# EAGLE design rodentdbs (EAGLE 9.6.2)

## Sheet 1 of 2
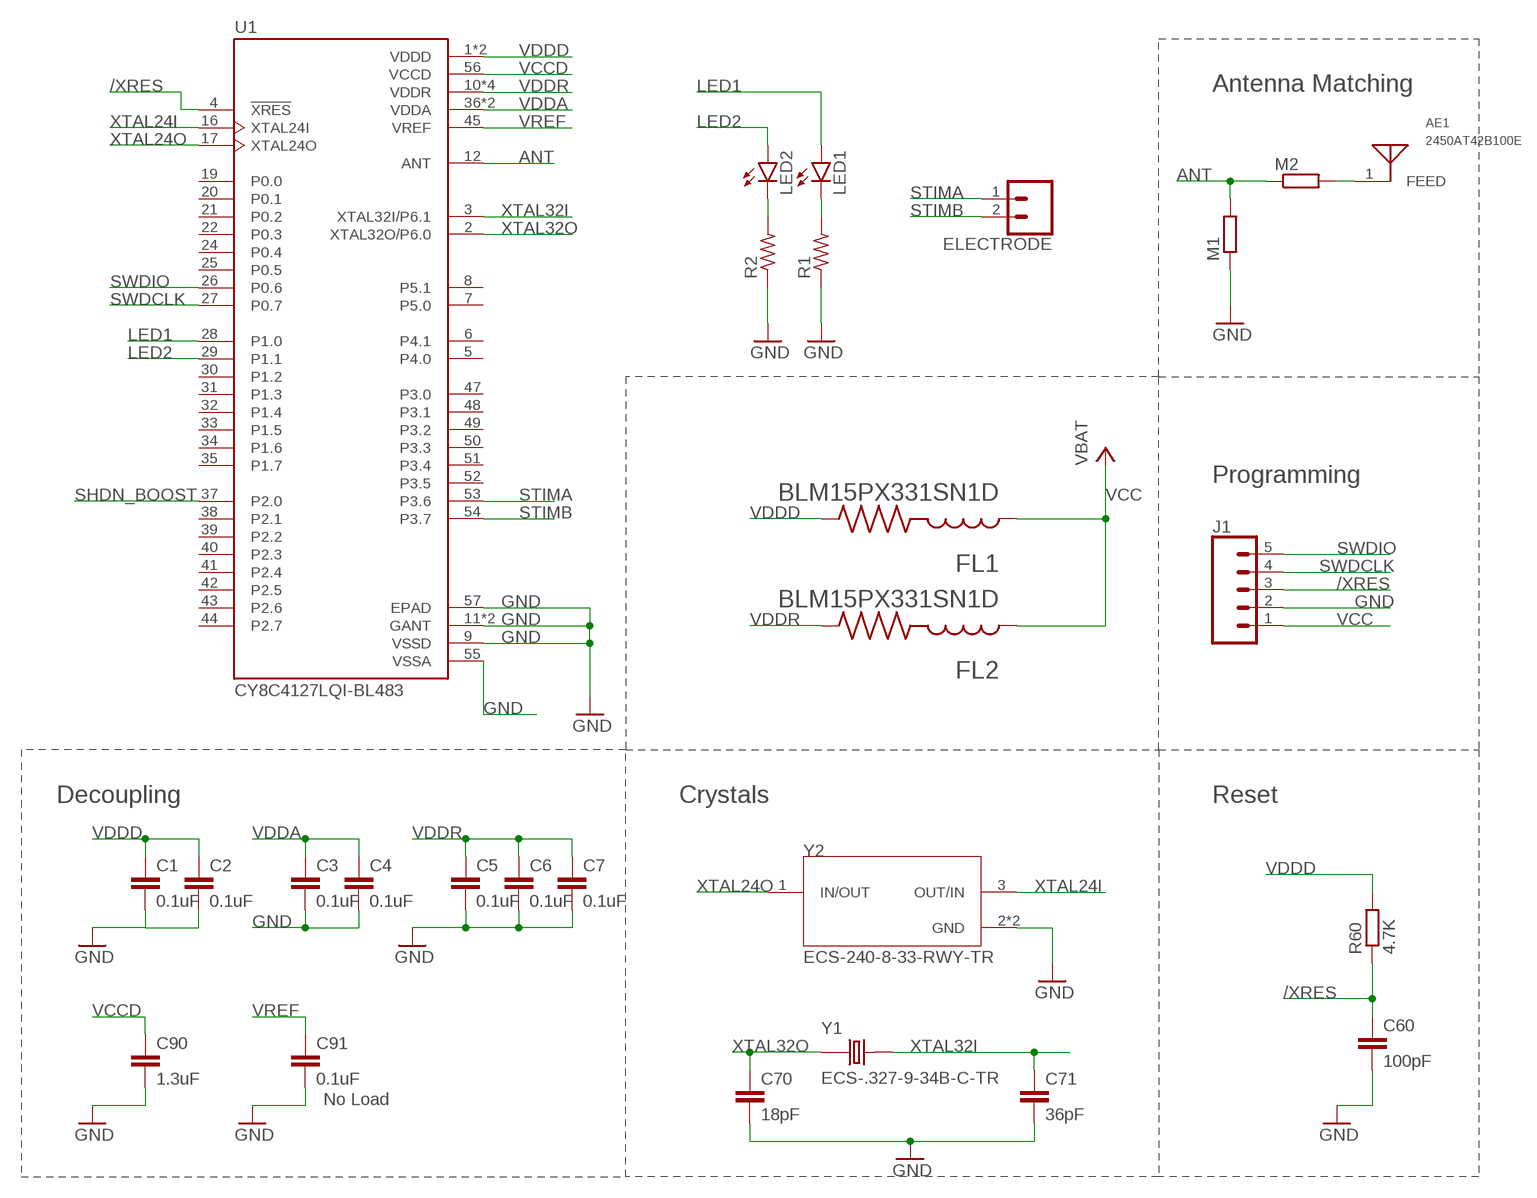
[diagram p0: schematic, sheet 1]

### Parts
AE1  2450AT42B100E  [XCVR_2450AT42B100E]
C1  0.1uF  C-EUC0402  [C0402]
C2  0.1uF  C-EUC0402  [C0402]
C3  0.1uF  C-EUC0402  [C0402]
C4  0.1uF  C-EUC0402  [C0402]
C5  0.1uF  C-EUC0402  [C0402]
C6  0.1uF  C-EUC0402  [C0402]
C7  0.1uF  C-EUC0402  [C0402]
C60  100pF  C-EUC0402  [C0402]
C70  18pF  C-EUC0402  [C0402]
C71  36pF  C-EUC0402  [C0402]
C90  1.3uF  C-EUC0402  [C0402]
C91  0.1uF  C-EUC0402  [C0402]
ELECTRODE  CONN_02  [1X02]
FL1  BLM15PX331SN1D  [BEADC1005X55N]
FL2  BLM15PX331SN1D  [BEADC1005X55N]
J1  CONN_05LOCK  [1X05_LOCK]
LED1  LEDSML0603  [SML0603]
LED2  LEDSML0603  [SML0603]
M1  R-EU_R0402  [R0402]
M2  R-EU_R0402  [R0402]
R1  R-US_R0402  [R0402]
R2  R-US_R0402  [R0402]
R60  4.7K  R-EU_R0402  [R0402]
U1  CY8C4127LQI-BL483  [QFN40P700X700X60-57N]
Y1  ECS-.327-9-34B-C-TR  [XTAL_ECS-.327-9-34B-C-TR]
Y2  ECS-240-8-33-RWY-TR  [XTAL_ECS-240-8-33-RWY-TR]

### Nets
/XRES: C60.1 J1.3 R60.1 U1.4(!XRES)
ANT: M1.2 M2.1 U1.12(ANT)
GND: C1.2 C2.2 C3.2 C4.2 C5.2 C6.2 C7.2 C60.2 C70.2 C71.2 C90.2 C91.2 J1.2 M1.1 R1.1 R2.1 U1.9(VSSD) U1.11(GANT) U1.13(GANT) U1.55(VSSA) U1.57(EPAD) Y2.2(GND) Y2.4(GND) ; also sheet 2
LED1: LED1.A U1.28(P1.0)
LED2: LED2.A U1.29(P1.1)
N$1: LED1.C R1.2
N$2: AE1.1(FEED) M2.2
N$3: LED2.C R2.2
SHDN_BOOST: U1.37(P2.0)
STIMA: ELECTRODE.1 U1.53(P3.6)
STIMB: ELECTRODE.2 U1.54(P3.7)
SWDCLK: J1.4 U1.27(P0.7)
SWDIO: J1.5 U1.26(P0.6)
VCC: FL1.1 FL2.1 J1.1 ; supply symbol labelled VBAT ; also sheet 2
VCCD: C90.1 U1.56(VCCD)
VDDA: C3.1 C4.1 U1.36(VDDA) U1.46(VDDA) ; also sheet 2
VDDD: C1.1 C2.1 FL1.2 R60.2 U1.1(VDDD) U1.23(VDDD)
VDDR: C5.1 C6.1 C7.1 FL2.2 U1.10(VDDR) U1.14(VDDR) U1.15(VDDR) U1.18(VDDR)
VREF: C91.1 U1.45(VREF)
XTAL24I: U1.16(XTAL24I) Y2.3(OUT/IN)
XTAL24O: U1.17(XTAL24O) Y2.1(IN/OUT)
XTAL32I: C71.1 U1.3(XTAL32I/P6.1) Y1.2
XTAL32O: C70.1 U1.2(XTAL32O/P6.0) Y1.1
Unconnected: U1.5(P4.0) U1.6(P4.1) U1.7(P5.0) U1.8(P5.1) U1.19(P0.0) U1.20(P0.1) U1.21(P0.2) U1.22(P0.3) U1.24(P0.4) U1.25(P0.5) U1.30(P1.2) U1.31(P1.3) U1.32(P1.4) U1.33(P1.5) U1.34(P1.6) U1.35(P1.7) U1.38(P2.1) U1.39(P2.2) U1.40(P2.3) U1.41(P2.4) U1.42(P2.5) U1.43(P2.6) U1.44(P2.7) U1.47(P3.0) U1.48(P3.1) U1.49(P3.2) U1.50(P3.3) U1.51(P3.4) U1.52(P3.5)

### Notes on the sheet
- Antenna Matching
- Programming
- Decoupling | Crystals | Reset
- No Load

## Sheet 2 of 2: Battery Boost
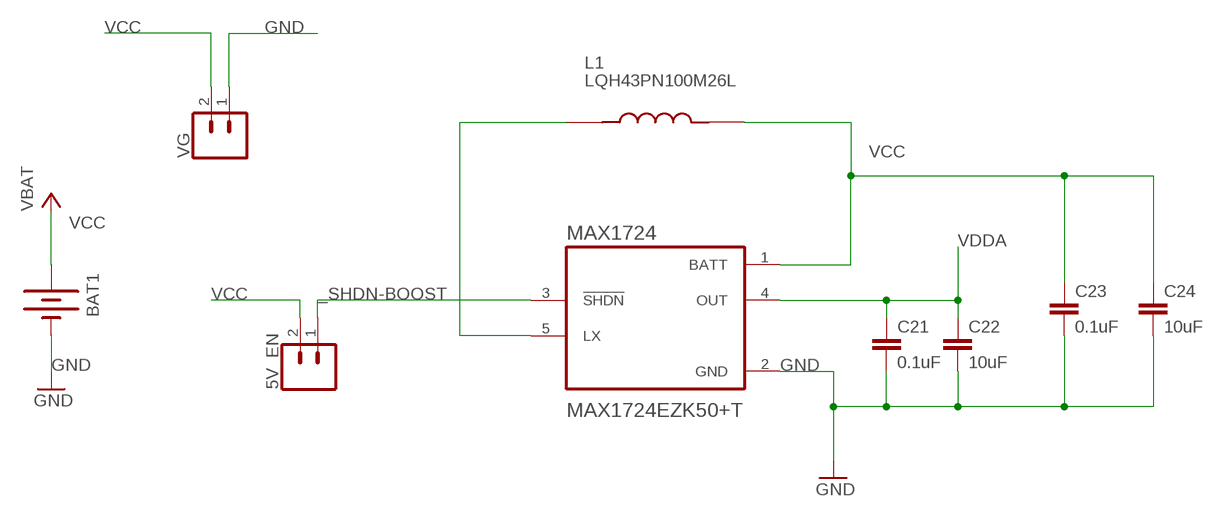
[diagram p1: schematic, sheet 2]

### Parts
5V_EN  CONN_02  [1X02]
BAT1  BATTERYBU2032SM  [BU2032SM]
C21  0.1uF  C-EUC0402  [C0402]
C22  10uF  C-EUC0603  [C0603]
C23  0.1uF  C-EUC0402  [C0402]
C24  10uF  C-EUC0603  [C0603]
L1  LQH43PN100M26L  [IND_LQH43PN100M26L]
MAX1724  MAX1724EZK50+T  [SOT95P275X110-5N]
VG  CONN_02  [1X02]

### Nets
_SHDN-BOOST: 5V_EN.1 MAX1724.3(!SHDN)
GND: BAT1.P$2(-) C21.2 C22.2 C23.2 C24.2 MAX1724.2(GND) VG.1 ; also sheet 1
N$8: L1.1 MAX1724.5(LX)
VCC: 5V_EN.2 BAT1.P$1(+) C23.1 C24.1 L1.2 MAX1724.1(BATT) VG.2 ; supply symbol labelled VBAT ; also sheet 1
VDDA: C21.1 C22.1 MAX1724.4(OUT) ; also sheet 1

## Library data of the parts
5V_EN ELECTRODE VG = SparkFun-Connectors:CONN_02: Multi connection point. Often used as Generic Header-pin footprint for 0.1 inch spaced/style header connections On any of the 0.1 inch spaced packages, you can populate with these: Break Away Headers - Straight <https://www.sparkfun.com/products/116> (PRT-00116) Break Away Male Headers - Right Angle <https://www.sparkfun.com/products/553> (PRT-00553) Female Headers <https://www.sparkfun.com/products/115> (PRT-00115) Break Away Headers - Machine Pin <https://www.sparkfun.com/products/117> (PRT-00117) Break Away Female Headers - Swiss Machine Pin <https://www.sparkfun.com/products/743> (PRT-00743) For SCREWTERMINALS and SPRING TERMINALS visit here: Screw Terimnals on SparkFun.com <https://www.sparkfun.com/search/results?term=Screw+Terminals> (5mm/3.5mm/2.54mm spacing) This device is also useful as a general connection point to wire up your design to another part of your project. Our various solder wires solder well into these plated through hole pads. Hook-Up Wire - Assortment (Stranded, 22 AWG) <https://www.sparkfun.com/products/11375> (PRT-11375) Hook-Up Wire - Assortment (Solid Core, 22 AWG) <https://www.sparkfun.com/products/11367> (PRT-11367) View the entire wire category on our website here <https://www.sparkfun.com/categories/141> Special notes: Molex polarized connector foot print use with: PRT-08233 with associated crimp pins and housings. 2.54_SCREWTERM for use with PRT-10571. 3.5mm Screw Terminal footprints for PRT-08084 5mm Screw Terminal footprints for use with PRT-08432
AE1 = 2450AT42B100E:2450AT42B100E: Antenna Chip 2.4ghz; DESCRIPTION: 2.4GHz - Chip RF Antenna 2.4GHz ~ 2.5GHz 0dBi Solder Surface Mount; DIGI-KEY_PART_NUMBER: 712-1008-2-ND; MF: Johanson Technology; MP: 2450AT42B100E; PACKAGE: None; PURCHASE-URL: https://pricing.snapeda.com/search/part/2450AT42B100E/?ref=eda
BAT1 = ELEC327:BATTERY: Battery Holders Various common sizes : AA, AAA, 20mm coin cell and 12mm coin cell. 20MM_4LEGS, BATT-10373
C1-C7 C21-C24 C60 C70 C71 C90 C91 = rcl:C-EU: CAPACITOR, European symbol; SPICEPREFIX: C
FL1 FL2 = BLM15PX331SN1D:BLM15PX331SN1D: BLM Series 0402 330 Ohm 1200 mA 0.15 Ohm DCR Surface Mount Ferrite Bead; DESCRIPTION: 330 Ohms @ 100 MHz 1 Power Line Ferrite Bead 0402 (1005 Metric) 1.2A 150mOhm; DIGI-KEY_PART_NUMBER: 490-11022-2-ND; MF: Murata Electronics; MP: BLM15PX331SN1D; PACKAGE: 1005 Taiyo Yuden; PURCHASE-URL: https://pricing.snapeda.com/search/part/BLM15PX331SN1D/?ref=eda
J1 = SparkFun-Connectors:CONN_05: Multi connection point. Often used as Generic Header-pin footprint for 0.1 inch spaced/style header connections On any of the 0.1 inch spaced packages, you can populate with these: Break Away Headers - Straight <https://www.sparkfun.com/products/116> (PRT-00116) Break Away Male Headers - Right Angle <https://www.sparkfun.com/products/553> (PRT-00553) Female Headers <https://www.sparkfun.com/products/115> (PRT-00115) Break Away Headers - Machine Pin <https://www.sparkfun.com/products/117> (PRT-00117) Break Away Female Headers - Swiss Machine Pin <https://www.sparkfun.com/products/743> (PRT-00743) For SCREWTERMINALS and SPRING TERMINALS visit here: Screw Terimnals on SparkFun.com <https://www.sparkfun.com/search/results?term=Screw+Terminals> (5mm/3.5mm/2.54mm spacing) This device is also useful as a general connection point to wire up your design to another part of your project. Our various solder wires solder well into these plated through hole pads. Hook-Up Wire - Assortment (Stranded, 22 AWG) <https://www.sparkfun.com/products/11375> (PRT-11375) Hook-Up Wire - Assortment (Solid Core, 22 AWG) <https://www.sparkfun.com/products/11367> (PRT-11367) View the entire wire category on our website here <https://www.sparkfun.com/categories/141> Special notes: Molex polarized connector foot print use with SKU : PRT-08231 with associated crimp pins and housings. 1MM SMD Version SKU: PRT-10208
L1 = LQH43PN100M26L:LQH43PN100M26L: Inductor Power Chip Unshielded Wirewound 10uH 10% 1MHz Ferrite 650mA 240mOhm DCR 1812 T/R; DESCRIPTION: Inductor with Inductance: 10uH Tol. +/-20%, Package: 1812 (4532); DIGI-KEY_PART_NUMBER: 490-12780-1-ND; MF: Murata; MP: LQH43PN100M26L; PACKAGE: NONSTANDARD; PURCHASE-URL: https://pricing.snapeda.com/search/part/LQH43PN100M26L/?ref=eda
LED1 LED2 = led:LED: LED OSRAM: - CHIPLED LG R971, LG N971, LY N971, LG Q971, LY Q971, LO R971, LY R971 LH N974, LH R974 LS Q976, LO Q976, LY Q976 LO Q996 - Hyper CHIPLED LW Q18S LB Q993, LB Q99A, LB R99A - SideLED LS A670, LO A670, LY A670, LG A670, LP A670 LB A673, LV A673, LT A673, LW A673 LH A674 LY A675 LS A676, LA A676, LO A676, LY A676, LW A676 LS A679, LY A679, LG A679 - Hyper Micro SIDELED® LS Y876, LA Y876, LO Y876, LY Y876 LT Y87S - SmartLED LW L88C, LW L88S LB L89C, LB L89S, LG L890 LS L89K, LO L89K, LY L89K LS L896, LA L896, LO L896, LY L896 - TOPLED LS T670, LO T670, LY T670, LG T670, LP T670 LSG T670, LSP T670, LSY T670, LOP T670, LYG T670 LG T671, LOG T671, LSG T671 LB T673, LV T673, LT T673, LW T673 LH T674 LS T676, LA T676, LO T676, LY T676, LB T676, LH T676, LSB T676, LW T676 LB T67C, LV T67C, LT T67C, LS T67K, LO T67K, LY T67K, LW E67C LS E67B, LA E67B, LO E67B, LY E67B, LB E67C, LV E67C, LT E67C LW T67C LS T679, LY T679, LG T679 LS T770, LO T770, LY T770, LG T770, LP T770 LB T773, LV T773, LT T773, LW T773 LH T774 LS E675, LA E675, LY E675, LS T675 LS T776, LA T776, LO T776, LY T776, LB T776 LHGB T686 LT T68C, LB T68C - Hyper Mini TOPLED® LB M676 - Mini TOPLED Santana® LG M470 LS M47K, LO M47K, LY M47K Source: http://www.osram.convergy.de LUXEON: - LUMILED® LXK2-PW12-R00, LXK2-PW12-S00, LXK2-PW14-U00, LXK2-PW14-V00 LXK2-PM12-R00, LXK2-PM12-S00, LXK2-PM14-U00 LXK2-PE12-Q00, LXK2-PE12-R00, LXK2-PE12-S00, LXK2-PE14-T00, LXK2-PE14-U00 LXK2-PB12-K00, LXK2-PB12-L00, LXK2-PB12-M00, LXK2-PB14-N00, LXK2-PB14-P00, LXK2-PB14-Q00 LXK2-PR12-L00, LXK2-PR12-M00, LXK2-PR14-Q00, LXK2-PR14-R00 LXK2-PD12-Q00, LXK2-PD12-R00, LXK2-PD12-S00 LXK2-PH12-R00, LXK2-PH12-S00 LXK2-PL12-P00, LXK2-PL12-Q00, LXK2-PL12-R00 Source: www.luxeon.com KINGBRIGHT: KA-3528ASYC Source: www.kingbright.com
M1 M2 R60 = rcl:R-EU_: RESISTOR, European symbol; SPICEPREFIX: R
MAX1724 = MAX1724EZK50_T:MAX1724EZK50+T; DESCRIPTION: Boost Switching Regulator IC Positive Fixed 5V 1 Output 400mA (Switch) SOT-23-5 Thin, TSOT-23-5; DIGI-KEY_PART_NUMBER: MAX1724EZK50+TCT-ND; MF: Maxim Integrated; MP: MAX1724EZK50+T; PACKAGE: SOT-23-5 Maxim; PURCHASE-URL: https://pricing.snapeda.com/search/part/MAX1724EZK50+T/?ref=eda
R1 R2 = rcl:R-US_: RESISTOR, American symbol; SPICEPREFIX: R
U1 = CY8C4127FNI-BL483T:CY8C4127LQI-BL483
Y1 = ECS-.327-9-34B-C-TR:ECS-.327-9-34B-C-TR: Crystal 2-SMD, No Lead; DESCRIPTION: 32.768 kHz ±10ppm Crystal 9pF 70 kOhms 2-SMD, No Lead; DIGI-KEY_PART_NUMBER: XC1949TR-ND; MF: ECS Inc.; MP: ECS-.327-9-34B-C-TR; PACKAGE: None; PURCHASE-URL: https://pricing.snapeda.com/search/part/ECS-.327-9-34B-C-TR/?ref=eda
Y2 = ECS-240-8-33-RWY-TR:ECS-240-8-33-RWY-TR; DESCRIPTION: Crystal 24MHz ±15ppm (Tol) ±15ppm (Stability) 8pF FUND 40Ohm 4-Pin Mini-CSMD T/R; DIGI-KEY_PART_NUMBER: XC2946TR-ND; MF: ECS Inc.; MP: ECS-240-8-33-RWY-TR; PACKAGE: SMD-4 ECS International; PURCHASE-URL: https://pricing.snapeda.com/search/part/ECS-240-8-33-RWY-TR/?ref=eda

## Board
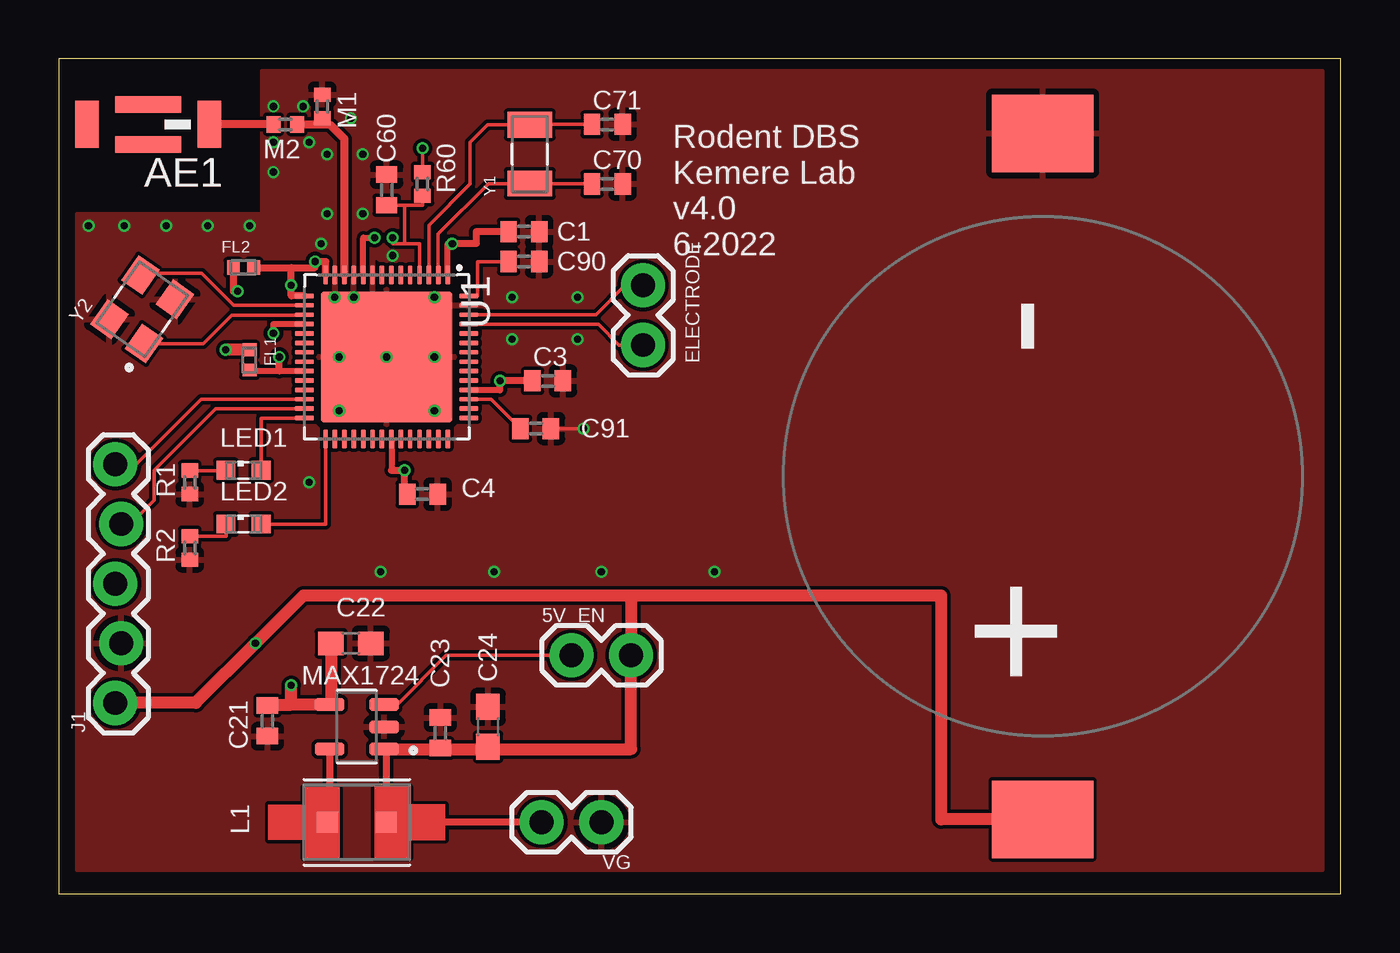
[diagram p2: board, top side]
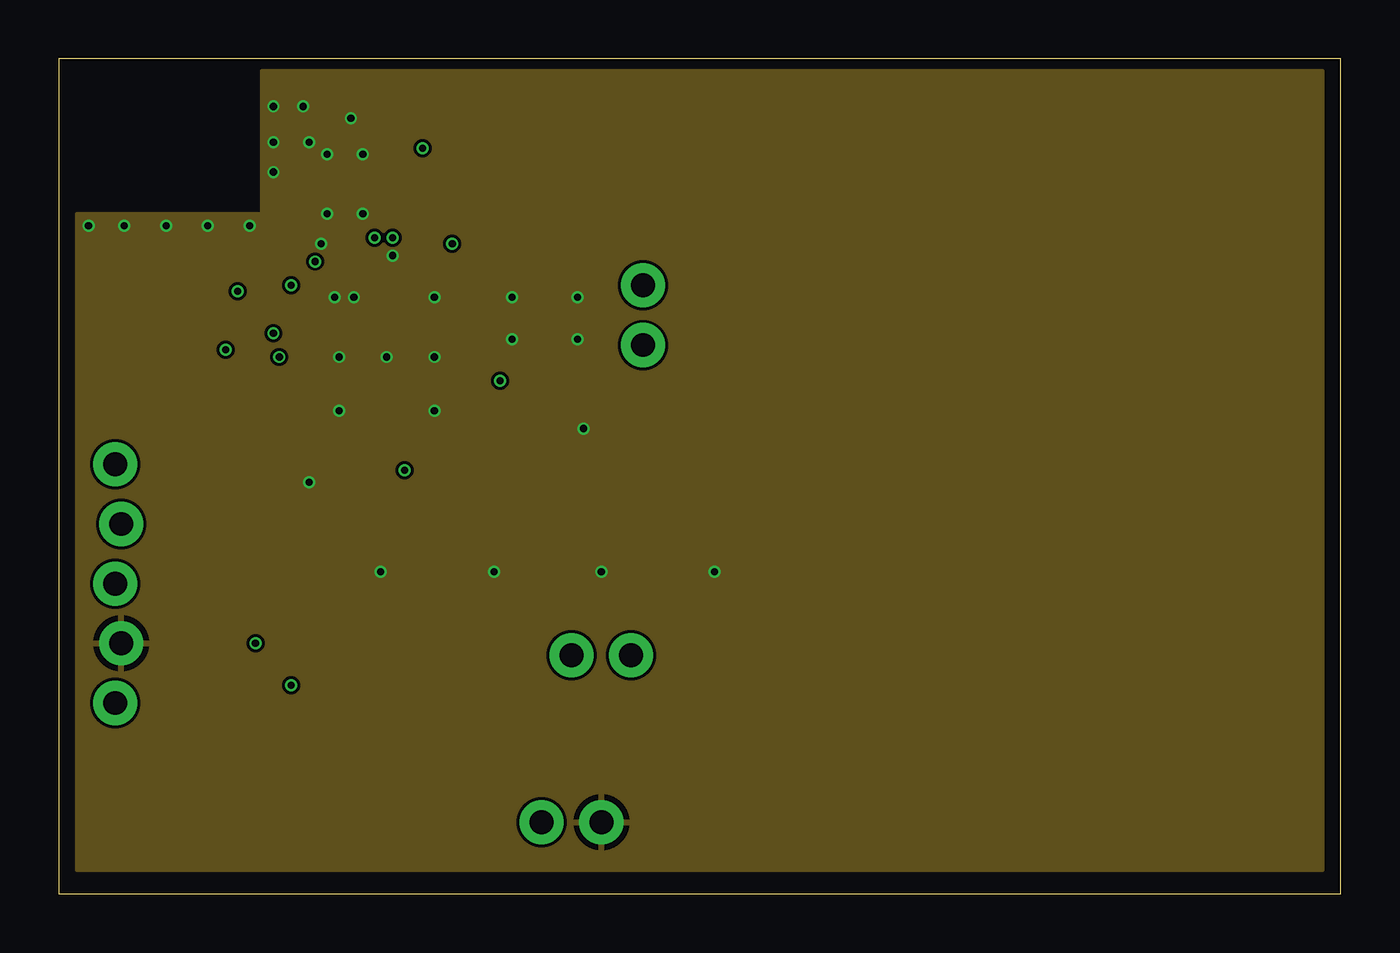
[diagram p3: board, inner layer Route2]
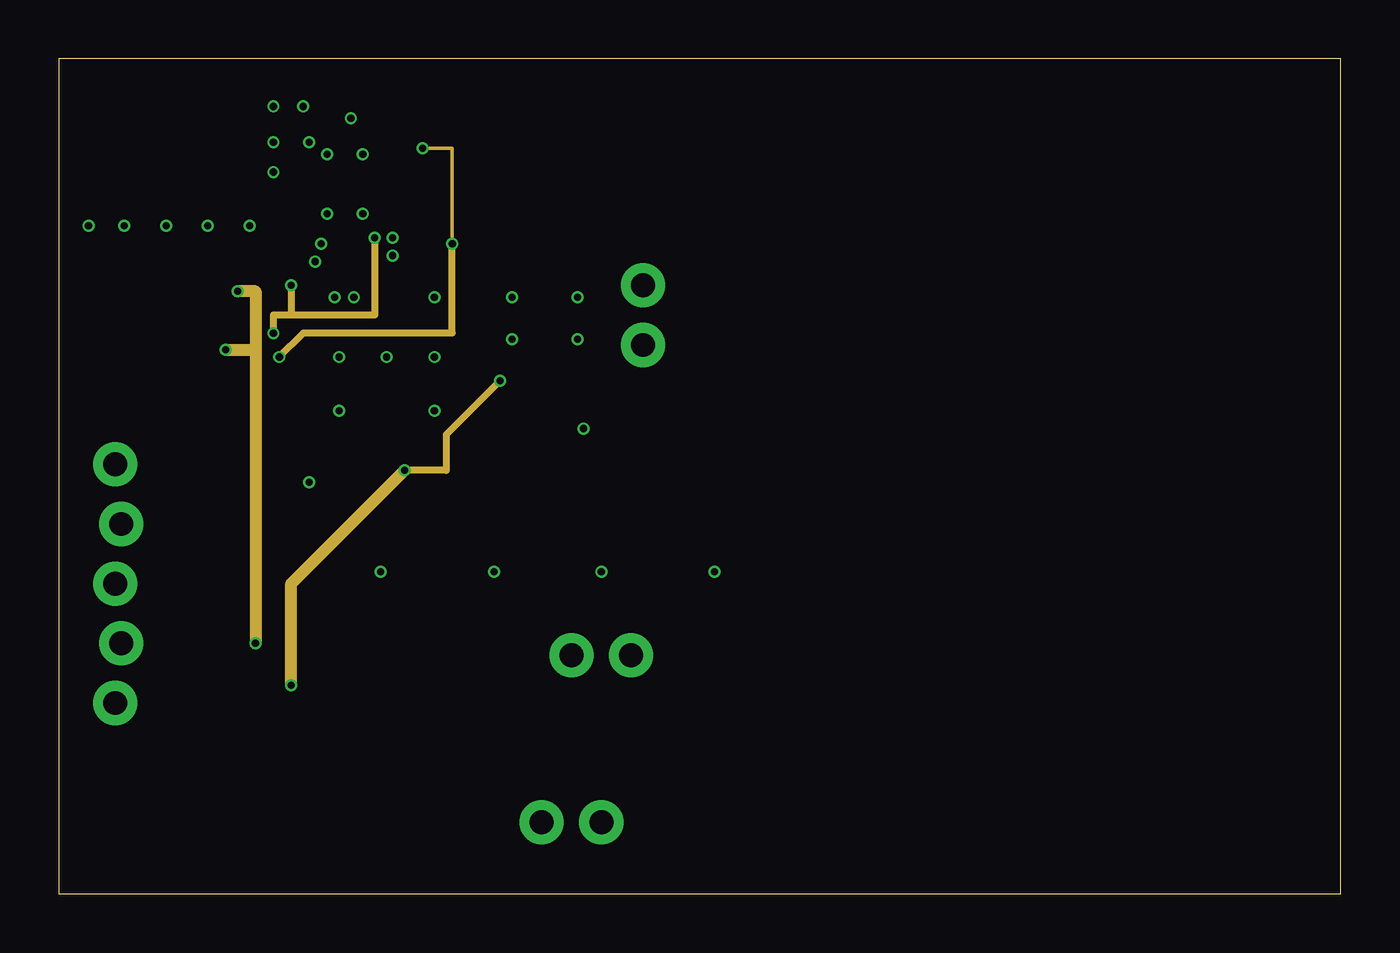
[diagram p4: board, inner layer Route15]
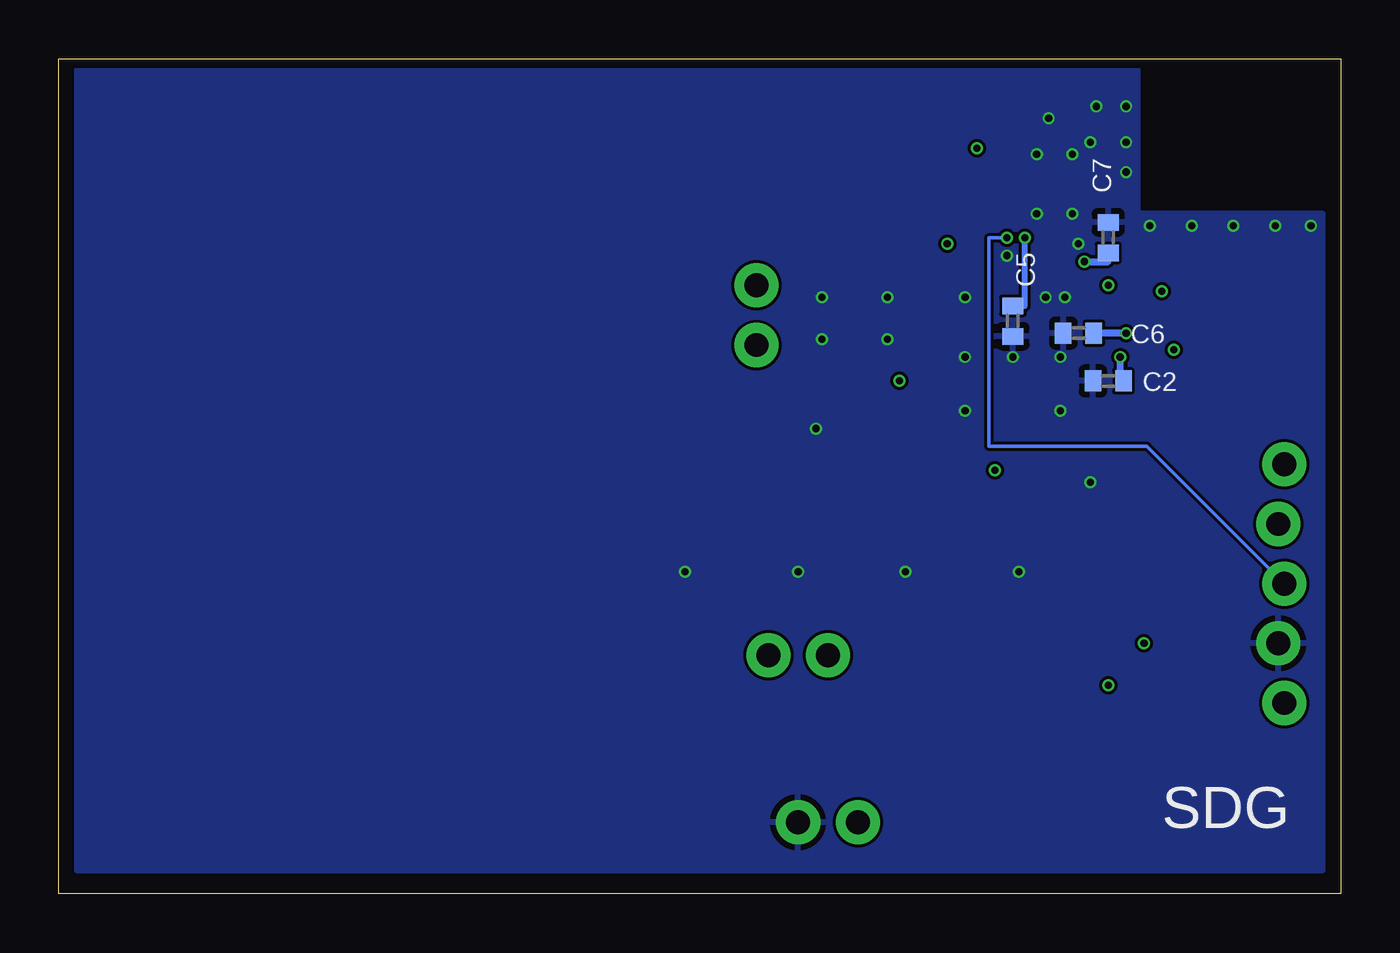
[diagram p5: board, bottom side, seen from below]

Size 54.61 x 35.56 mm. Coordinates in mm from the lower left corner, seen from the top.
Outline: 0,0 54.61,0 54.61,35.56 0,35.56 0,0
Copper layers (1*2*15*16): Top 0.04318125mm / dielectric 0.202184375mm / Route2 0.017271875mm / dielectric 47mil / Route15 0.017271875mm / dielectric 0.202184375mm / Bottom 0.04318125mm
Design rules "oshpark-4layer *": minimum track width 5mil, minimum drill 10mil, track to track 5mil, track to pad 5mil, pad to pad 5mil, via to via 5mil, smd to smd 5mil, copper to edge 15mil, drill to drill 6mil, minimum pad ring 4mil, minimum via ring 4mil, stop-mask expansion 1.5mil, vias tented up to drill 0mil, thermal gap 10mil

### Footprints (pad centres in the part's own frame; a part is rotated, then mirrored left to right if it is on the bottom)
1X02 = drill 1.016 pad 1.88: 1 0,0; 2 2.54,0
XCVR_2450AT42B100E = smd 1 x 2: 1 -2.6,0; 2 2.6,0 | smd 2.8 x 0.7: 3 0,-0.85; 4 0,0.85
BU2032SM = smd 3.302 x 4.318: P$1 -14.605,0; P$2 14.605,0
C0402 = smd 0.7 x 0.9: 1 -0.65,0; 2 0.65,0
C0603 = smd 1.1 x 1: 1 -0.85,0; 2 0.85,0
BEADC1005X55N = smd 0.54 x 0.6: 1 -0.432,0; 2 0.432,0
1X05_LOCK = drill 1.016 pad 1.88: 1 0,0.127; 2 2.54,-0.127; 3 5.08,0.127; 4 7.62,-0.127; 5 10.16,0.127
IND_LQH43PN100M26L = smd 0.9 x 0.9: 1 -1.25,0; 2 1.25,0
SML0603 = smd 0.8 x 0.8: A 0.75,0; C -0.75,0
R0402 = smd 0.6 x 0.7: 1 -0.5,0; 2 0.5,0
SOT95P275X110-5N = smd 1.24 x 0.55: 1 -1.16,0.95; 2 -1.16,0; 3 -1.16,-0.95; 4 1.16,-0.95; 5 1.16,0.95
QFN40P700X700X60-57N = smd 0.8 x 0.2: 1 -3.5,2.6; 2 -3.5,2.2; 3 -3.5,1.8; 4 -3.5,1.4; 5 -3.5,1; 6 -3.5,0.6; 7 -3.5,0.2; 8 -3.5,-0.2; 9 -3.5,-0.6; 10 -3.5,-1; 11 -3.5,-1.4; 12 -3.5,-1.8; 13 -3.5,-2.2; 14 -3.5,-2.6; 29 3.5,-2.6; 30 3.5,-2.2; 31 3.5,-1.8; 32 3.5,-1.4; 33 3.5,-1; 34 3.5,-0.6; 35 3.5,-0.2; 36 3.5,0.2; 37 3.5,0.6; 38 3.5,1; 39 3.5,1.4; 40 3.5,1.8; 41 3.5,2.2; 42 3.5,2.6 | smd 0.2 x 0.8: 15 -2.6,-3.5; 16 -2.2,-3.5; 17 -1.8,-3.5; 18 -1.4,-3.5; 19 -1,-3.5; 20 -0.6,-3.5; 21 -0.2,-3.5; 22 0.2,-3.5; 23 0.6,-3.5; 24 1,-3.5; 25 1.4,-3.5; 26 1.8,-3.5; 27 2.2,-3.5; 28 2.6,-3.5; 43 2.6,3.5; 44 2.2,3.5; 45 1.8,3.5; 46 1.4,3.5; 47 1,3.5; 48 0.6,3.5; 49 0.2,3.5; 50 -0.2,3.5; 51 -0.6,3.5; 52 -1,3.5; 53 -1.4,3.5; 54 -1.8,3.5; 55 -2.2,3.5; 56 -2.6,3.5 | smd 5.6 x 5.6: 57 0,0
XTAL_ECS-.327-9-34B-C-TR = smd 1.1 x 1.9: 1 -1.25,0; 2 1.25,0
XTAL_ECS-240-8-33-RWY-TR = smd 1.3 x 1.1: 1 -1.15,-0.9; 2 1.15,-0.9; 3 1.15,0.9; 4 -1.15,0.9

### Placement (x,y rotation side)
5V_EN  21.84,10.16 0 top
AE1  3.81,32.77 180 top
BAT1  41.91,17.78 90 top
C1  19.81,28.19 0 top
C2  9.91,21.84 180 bottom
C3  20.83,21.84 0 top
C4  15.49,17.02 0 top
C5  13.97,24.38 270 bottom
C6  11.18,23.88 180 bottom
C7  9.91,27.94 90 bottom
C21  8.89,7.37 270 top
C22  12.45,10.67 0 top
C23  16.26,6.86 90 top
C24  18.29,7.11 90 top
C60  13.97,29.97 90 top
C70  23.37,30.23 0 top
C71  23.37,32.77 0 top
C90  19.81,26.92 0 top
C91  20.32,19.81 0 top
ELECTRODE  24.89,23.37 90 top
FL1  8.13,22.73 270 top
FL2  7.87,26.67 0 top
J1  2.54,8.13 90 top
L1  12.7,3.05 0 top
LED1  7.87,18.03 0 top
LED2  7.87,15.75 0 top
M1  11.23,33.53 270 top
M2  9.65,32.77 180 top
MAX1724  12.7,7.11 180 top
R1  5.59,17.53 90 top
R2  5.59,14.73 90 top
R60  15.49,30.23 90 top
U1  13.97,22.86 270 top
VG  23.11,3.05 180 top
Y1  20.07,31.5 90 top
Y2  3.56,24.89 55 top

### Tracks (layer width: path | path; a pad name or v marks a point on that pad's centre or on a via)
/XRES  (via drill 0.3)
  Top 0.152: U1.4 15.37,27.69 14.73,27.69 | 14.73,29.32 14.73,27.69 | R60.1 15.49,29.32 14.73,29.32 | C60.1 14.73,29.32 | 14.73,27.69 14.22,27.69 v14.22,27.94
  Bottom 0.152: v14.22,27.94 14.99,27.94 14.99,19.05 8.26,19.05 J1.3
_SHDN-BOOST
  Top 0.152: MAX1724.3 14.41,8.06 16.51,10.16 5V_EN.1
ANT
  Top 0.34: U1.12 12.17,32.13 11.54,32.77 11.18,32.77 | M2.1 11.18,32.77 | M1.2 11.18,32.77
GND  (via drill 0.3)
  Top 0.152: C91.2 v22.35,19.81
  other vias: 11.18,27.69 11.94,22.86 16,22.86 16,25.4 16,20.57 11.94,20.57 12.95,28.96 12.95,31.5 11.43,31.5 11.43,28.96 10.67,32 10.41,33.53 12.45,33.02 1.27,28.45 2.79,28.45 4.57,28.45 6.35,28.45 8.13,28.45 9.14,30.73 9.14,32 9.14,33.53 10.67,17.53 14.22,27.18 13.97,22.86 13.72,13.72 18.54,13.72 23.11,13.72 27.94,13.72 19.3,23.62 22.1,23.62 19.3,25.4 22.1,25.4 11.76,25.4 12.57,25.4
  pour Bottom (rank 6): 0.76,28.96 8.64,28.96 8.64,35.05 53.85,35.05 53.85,1.02 0.76,1.02
  pour Top (isolate 0.152, rank 6): 0.76,28.96 0.76,1.02 53.85,1.02 53.85,35.05 8.64,35.05 8.64,28.96
  pour Route2 (rank 6): 0.76,28.96 0.76,1.02 53.85,1.02 53.85,35.05 8.64,35.05 8.64,28.96
LED1
  Top 0.152: LED1.A 8.62,20.26 U1.28
LED2
  Top 0.152: U1.29 11.37,15.75 LED2.A
N$1
  Top 0.152: LED1.C R1.2
N$2
  Top 0.34: M2.2 AE1.1
N$3
  Top 0.152: R2.2 7.12,15.23 LED2.C
N$8
  Top 0.305: MAX1724.5 11.54,3.05 L1.1
STIMA
  Top 0.152: U1.53 22.98,24.26 23.88,23.37 ELECTRODE.1
STIMB
  Top 0.152: U1.54 22.88,24.66 24.13,25.91 ELECTRODE.2
SWDCLK
  Top 0.152: U1.27 7.62,20.66 7.45,20.66 6.69,20.66 4.06,18.03 4.06,16.76 3.05,15.75 J1.4
SWDIO
  Top 0.152: U1.26 6.07,21.06 3.3,18.29 J1.5
VCC  (via drill 0.3)
  Top 0.305: MAX1724.1 13.95,6.16 L1.2 VG.2 | FL2.1 7.44,25.65 v7.62,25.65
  Top 0.508: BAT1.P$1 37.59,3.17 37.59,12.7 24.38,12.7 | FL1.1 v7.11,23.16 | 24.38,12.7 10.41,12.7 v8.38,10.67 5.84,8.13 J1.1 | 24.38,12.7 5V_EN.2 24.38,6.16 18.29,6.16 | MAX1724.1 16.26,6.16 | 16.26,6.16 18.29,6.16 | C24.1 18.29,6.16 | C23.1 16.26,6.16
  Route15 0.508: v7.62,25.65 8.38,25.65 8.38,23.16 | v7.11,23.16 8.38,23.16 | 8.38,23.16 v8.38,10.67
VCCD
  Top 0.152: U1.56 17.84,25.46 17.84,26.92 C90.1
VDDA  (via drill 0.3)
  Top 0.254: U1.46 18.8,21.46 | U1.36 14.17,18.03
  Top 0.305: 18.8,21.46 v18.8,21.84 C3.1 | 14.17,18.03 v14.73,18.03 14.73,17.02 C4.1
  Top 0.508: 9.91,8.06 MAX1724.4 11.6,8.06 C22.1 | 9.91,8.06 v9.91,8.89 | C21.1 8.89,8.06 9.91,8.06
  Route15 0.305: v18.8,21.84 16.51,19.56 16.51,18.03 v14.73,18.03
  Route15 0.508: v9.91,8.89 9.91,13.21 v14.73,18.03
VDDD  (via drill 0.3)
  Top 0.152: U1.23 9.4,22.26 | v15.49,31.75 R60.2
  Top 0.254: U1.23 8.13,22.26 FL1.2 | U1.1 16.57,27.69 v16.76,27.69
  Top 0.305: 9.4,22.26 v9.4,22.86 | C1.1 17.78,28.19 17.78,27.69 v16.76,27.69
  Route15 0.152: v15.49,31.75 16.76,31.75 v16.76,27.69
  Route15 0.305: v9.4,22.86 10.41,23.88 16.76,23.88 v16.76,27.69
  Bottom 0.305: C2.1 9.4,21.84 v9.4,22.86
VDDR  (via drill 0.3)
  Top 0.254: U1.10 12.97,27.92 12.99,27.94 v13.46,27.94 | U1.18 9.14,24.26 v9.14,23.88
  Top 0.305: U1.14 11.37,26.92 v10.92,26.92 10.92,26.67 9.91,26.67 | U1.15 9.91,25.46 v9.91,25.91 9.91,26.67 | FL2.2 9.91,26.67
  Route15 0.305: v13.46,27.94 13.46,24.64 9.91,24.64 | 9.91,24.64 9.14,24.64 v9.14,23.88 | v9.91,25.91 9.91,24.64
  Bottom 0.254: C5.1 13.46,25.03 v13.46,27.94
  Bottom 0.305: v9.14,23.88 C6.1 | v10.92,26.92 9.91,26.92 C7.1
VREF
  Top 0.152: U1.45 18.42,21.06 C91.1
XTAL24I
  Top 0.152: U1.16 7.45,25.06 6.1,26.42 3.54,26.42 Y2.3
XTAL24O
  Top 0.152: U1.17 10.47,24.64 7.37,24.64 6.16,23.43 Y2.1
XTAL32I
  Top 0.152: U1.3 15.77,28.47 17.53,30.23 17.53,32 18.27,32.75 19.81,32.75 | 19.81,32.75 Y1.2 | C71.1 19.83,32.77 19.81,32.75
XTAL32O
  Top 0.152: U1.2 16.17,28.11 18.31,30.25 Y1.1 20.09,30.23 C70.1

### Text on the board
tPlace: Rodent DBS / Kemere Lab / v4.0 / 6-2022
bPlace: SDG